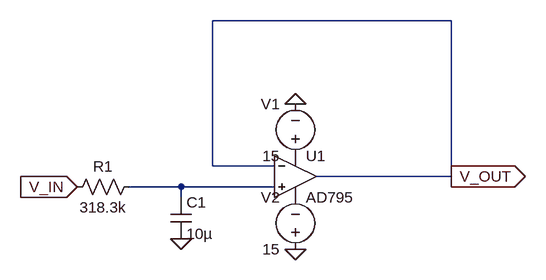
[diagram p0: schematic DC_extractor.asc]
DC_extractor.asc, the LTspice schematic file:
Version 4.1
SHEET 1 880 680
WIRE 528 -128 160 -128
WIRE 160 96 160 -128
WIRE 256 96 160 96
WIRE 528 112 528 -128
WIRE 528 112 320 112
WIRE 112 128 32 128
WIRE 256 128 112 128
WIRE 112 144 112 128
FLAG 288 0 0
FLAG 288 224 0
FLAG 112 208 0
FLAG -48 128 V_IN
IOPIN -48 128 In
FLAG 528 112 V_OUT
IOPIN 528 112 Out
SYMBOL res 48 112 R90
WINDOW 0 0 56 VBottom 2
WINDOW 3 32 56 VTop 2
SYMATTR InstName R1
SYMATTR Value 318.3k
SYMBOL cap 96 144 R0
SYMATTR InstName C1
SYMATTR Value 10µ
SYMBOL OpAmps\\AD795 288 48 R0
SYMATTR InstName U1
SYMBOL voltage 288 96 R180
WINDOW 0 24 96 Left 2
WINDOW 3 24 16 Left 2
WINDOW 123 0 0 Left 0
WINDOW 39 0 0 Left 0
SYMATTR InstName V1
SYMATTR Value 15
SYMBOL voltage 288 240 R180
WINDOW 0 24 96 Left 2
WINDOW 3 24 16 Left 2
WINDOW 123 0 0 Left 0
WINDOW 39 0 0 Left 0
SYMATTR InstName V2
SYMATTR Value 15

The netlist it stands for:
* DC_extractor.asc
R1 N001 V_IN 318.3k
C1 N001 0 10µ
X§U1 N001 V_OUT P001 P002 V_OUT AD795  ; pins In+ In- V+ V- OUT
V1 P001 0 15
V2 0 P002 15
.lib ADI1.lib
.backanno
.end